# Altium schematic sheet USB.SchDoc
size B; SheetNumber: 13; SheetTotal: 15
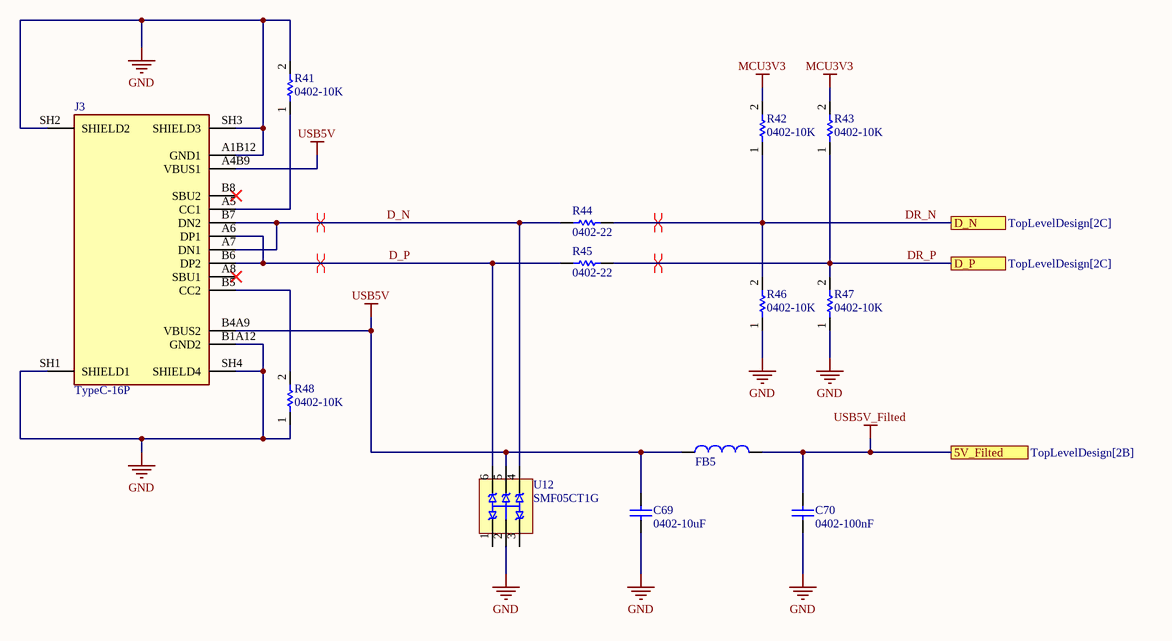
[diagram p0: USB.SchDoc]

## Parts
C69  0402-10uF  [CAPC0402(1005)60_N]
C70  0402-100nF  [CAPC0402(1005)60_N]
FB5  03060360110225  [FER_0603]  (value not drawn)
J3  TypeC-16P  [MOLEX_2171790001]
R41  0402-10K  [R-0402-10K]
R42  0402-10K  [R-0402-10K]
R43  0402-10K  [R-0402-10K]
R44  0402-22  [R-0402-1K]
R45  0402-22  [R-0402-1K]
R46  0402-10K  [R-0402-10K]
R47  0402-10K  [R-0402-10K]
R48  0402-10K  [R-0402-10K]
U12  SMF05CT1G  [SOT65P210X110-6N]

## Ports
5V_Filted (see TopLevelDesign[2B]), D_N (see TopLevelDesign[2C]), D_P (see TopLevelDesign[2C])

## Nets
GND: C69.1 C70.1 J3.A1B12(GND1) J3.B1A12(GND2) J3.SH1(SHIELD1) J3.SH2(SHIELD2) J3.SH3(SHIELD3) J3.SH4(SHIELD4) R41.2 R46.1 R47.1 R48.1 U12.2(A)
MCU3V3: R42.2 R43.2
USB5V: C69.2 FB5.1 J3.A4B9(VBUS1) J3.B4A9(VBUS2) U12.5(C4)
USB5V_Filted: C70.2 FB5.2 ; port 5V_Filted
D_N: J3.A7(DN1) J3.B7(DN2) R44.1 U12.4(C3)
D_P: J3.A6(DP1) J3.B6(DP2) R45.1 U12.6(C5)
DR_N: R42.1 R44.2 R46.2 ; port D_N
DR_P: R43.1 R45.2 R47.2 ; port D_P
NetJ3_A5: J3.A5(CC1) R41.1
NetJ3_B5: J3.B5(CC2) R48.2

Not connected (* = marked no-connect by the designer): J3 A8(SBU1)* B8(SBU2)*; U12 1(C1) 3(C2)

## Layout directives
differential pair; differential pair class USB_In; rule Matched Net Lengths [Delay Tolerance = 5ps]: D_N, D_P
differential pair; differential pair class USB_Out; rule Matched Net Lengths [Delay Tolerance = 5ps]: DR_N, DR_P

## Library data of the parts
C69 = CMP-001-00352-3: Capacitor 10uF 0402s; Tolerance: 20%; Value: 10µF; Dielectric: X5R; Voltage Rating (DC): 4V; Width: 0.02inch; Packaging: Tape and Reel; RoHS Compliant: Yes; Series: M; Mount: Surface Mount; Termination: SMD/SMT; Source: 0402-10uF.SchLib; Design Item ID: CMP-1034-02139-2; Min Operating Temperature: -55°C; Construction: Flat; Component Type: Standard; Case Code (Metric): 1005; Length: 0.039inch; Height: 0.5mm; Pins: 2; Thickness: 0.028inch; Voltage Rating: 4V; Package Quantity: 1; Max Operating Temperature: 85°C; Halogen Free: Halogen Free; Case/Package: 0402
C70 = CMP-001-00354-3: Capacitor 100nF 0402; Tolerance: 20%; Voltage Rating (DC): 4V; Dielectric: X5R; Series: M; RoHS Compliant: Yes; Max Operating Temperature: 85°C; Length: 0.039inch; Thickness: 0.028inch; Mount: Surface Mount; Min Operating Temperature: -55°C; Height: 0.5mm; Packaging: Tape and Reel; Construction: Flat; Termination: SMD/SMT; Source: 0402-10uF.SchLib; Design Item ID: CMP-1034-02139-2; Case/Package: 0402; Voltage Rating: 4V; Pins: 2; Value: 100nF; Width: 0.02inch; Component Type: Standard; Package Quantity: 1; Halogen Free: Halogen Free; Case Code (Metric): 1005
FB5 = CMP-006-00090-1: Ferrite, 0603, 600 Ohms, 1 A; Manufacture Name: Wurth Elektronik; Manufacture SN: 742792651; Maximum DC Resistance: 200 mOhms; Maximum DC Current: 1 A; Test Frequency: 100MHz; Tolerance: 25%; Design Item ID: 03060360110225; Impedance: 600 Ohms; Supplier 2 URL: N/A; Supplier 1 URL: https://www.mouser.com/ProductDetail/Wurth-Elektronik/742792651?qs=sGAEpiMZZMt1hubY80%2Fs8M60rIzA20dgTaAssd1%2FEf4%3D&utm_source=mouser-refine-download&utm_medium=file&utm_campaign=742792651&utm_content=Wurth-Elektronik; Supplier 1 SN: 710-742792651; Size: 0603; Operating Temperature: -55 to +125degC; Supplier 1 Name: Mouser; Packaging: Tape and Reel; Pins: 2; Supplier 2 SN: N/A; Supplier 3 Name: thegioiic; Supplier 3 URL: N/A; Supplier 2 Name: Digi-Key; Source: Ferrite_Bead_0603.SchLib; Mounting Technology: SMT; Supplier 3 SN: N/A; Component Type: Standard
J3 = CMP-002-01572-3: USB Type C - Connector, Top-mount SMT, 16pos; MF: Molex; MP: 217179-0001; Check_prices: https://www.snapeda.com/parts/217179-0001/Molex/view-part/?ref=eda; Design Item ID: 2171790001; Component Type: Standard; SnapEDA_Link: https://www.snapeda.com/parts/217179-0001/Molex/view-part/?ref=snap; Case/Package: None; Value: *; Source: 2171790001.SchLib; Pins: 16
R41-R43 R46-R48 = CMP-009-00675-4: RES 0402 10K; Value: 10k
R44 R45 = CMP-009-00695-1: 0402Resistor 22Ohm; Value: 22
U12 = CMP-004-00115-2: 12.5V Clamp 8A (8/20Âµs) Ipp Tvs Diode Surface Mount SC-88/SC70-6/SOT-363; MF: ON Semiconductor; Case/Package: SC-88-6 ON Semiconductor; Check_prices: https://www.snapeda.com/parts/SMF05CT1G/Onsemi/view-part/?ref=eda; Component Type: Standard; MP: SMF05CT1G; Pins: 6; Value: *; SnapEDA_Link: https://www.snapeda.com/parts/SMF05CT1G/Onsemi/view-part/?ref=snap; Source: SMF05CT1G.SchLib; Design Item ID: SMF05CT1G